# EAGLE schematic Low Voltage Regulator (EAGLE 7.2.0)
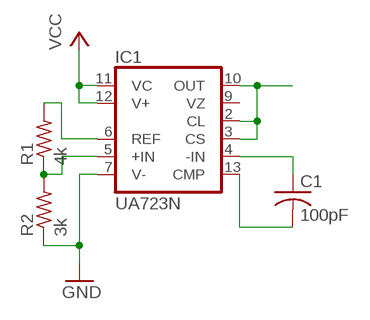
[diagram p0: schematic, sheet 1]

## Parts
C1  100pF  C-US050-025X075  [C050-025X075]
IC1  UA723N  [DIL14]
R1  4k  R-US_0207/10  [0207/10]
R2  3k  R-US_0207/10  [0207/10]

## Nets
GND: IC1.7(V-) R2.1
N$1: IC1.6(REF) R1.2
N$2: IC1.5(+IN) R1.1 R2.2
N$3: C1.1 IC1.4(-IN)
N$4: C1.2 IC1.13(CMP)
N$5: IC1.2(CL) IC1.3(CS) IC1.10(OUT)
VCC: IC1.11(VC) IC1.12(V+)
Unconnected: IC1.9(VZ)

## Library data of the parts
C1 = rcl:C-US: CAPACITOR, American symbol
IC1 = linear:*723: Positive VOLTAGE REGULATOR
R1 R2 = rcl:R-US_: RESISTOR, American symbol